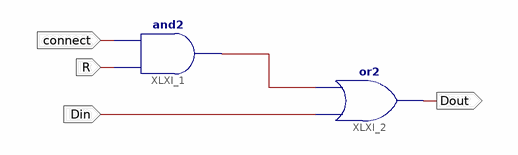
[diagram p0: schematic sheet 1]
// Xilinx ISE schematic connecteur.sch (spartan3e) as structural Verilog: 2 symbols, 4 ports
module connecteur (
  input  R,
  input  connect,
  input  Din,
  output Dout
);

  wire XLXN_2;

  and XLXI_1 (XLXN_2, R, connect);
  or XLXI_2 (Dout, Din, XLXN_2);
endmodule
